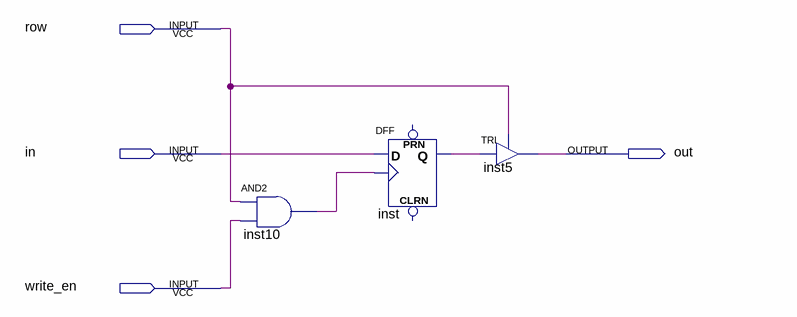
[diagram p0: schematic sheet]
// Quartus schematic cell.bdf as structural Verilog: 3 symbols, 4 pins
module \cell  (
  input  row,
  input  in,
  input  write_en,
  output out
);

  wire inst10_out, inst_q;

  and inst10 (inst10_out, row, write_en);
  DFF inst (.CLK(inst10_out), .D(in), .Q(inst_q));  // open: CLRN, PRN
  TRI inst5 (.IN(inst_q), .OE(row), .OUT(out));
endmodule
